# EAGLE design sata-hub3 (EAGLE 6.5.0)
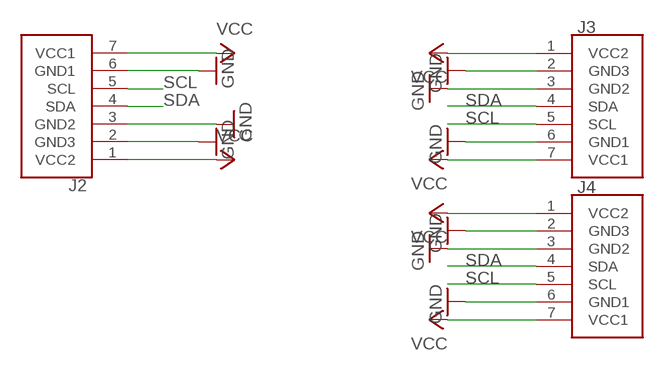
[diagram p0: schematic, sheet 1]

## Parts
J2  SATA7-RA  [SATA7-RA]
J3  SATA7-RA  [SATA7-RA]
J4  SATA7-RA  [SATA7-RA]

## Nets
GND: J2.2(GND3) J2.3(GND2) J2.6(GND1) J3.2(GND3) J3.3(GND2) J3.6(GND1) J4.2(GND3) J4.3(GND2) J4.6(GND1)
SCL: J2.5(SCL) J3.5(SCL) J4.5(SCL)
SDA: J2.4(SDA) J3.4(SDA) J4.4(SDA)
VCC: J2.1(VCC2) J2.7(VCC1) J3.1(VCC2) J3.7(VCC1) J4.1(VCC2) J4.7(VCC1)

## Library data of the parts
J2-J4 = dan-pc:SATA7: SATA 7-pin connector From host perspective, A is transmit and B is receive.

## Board
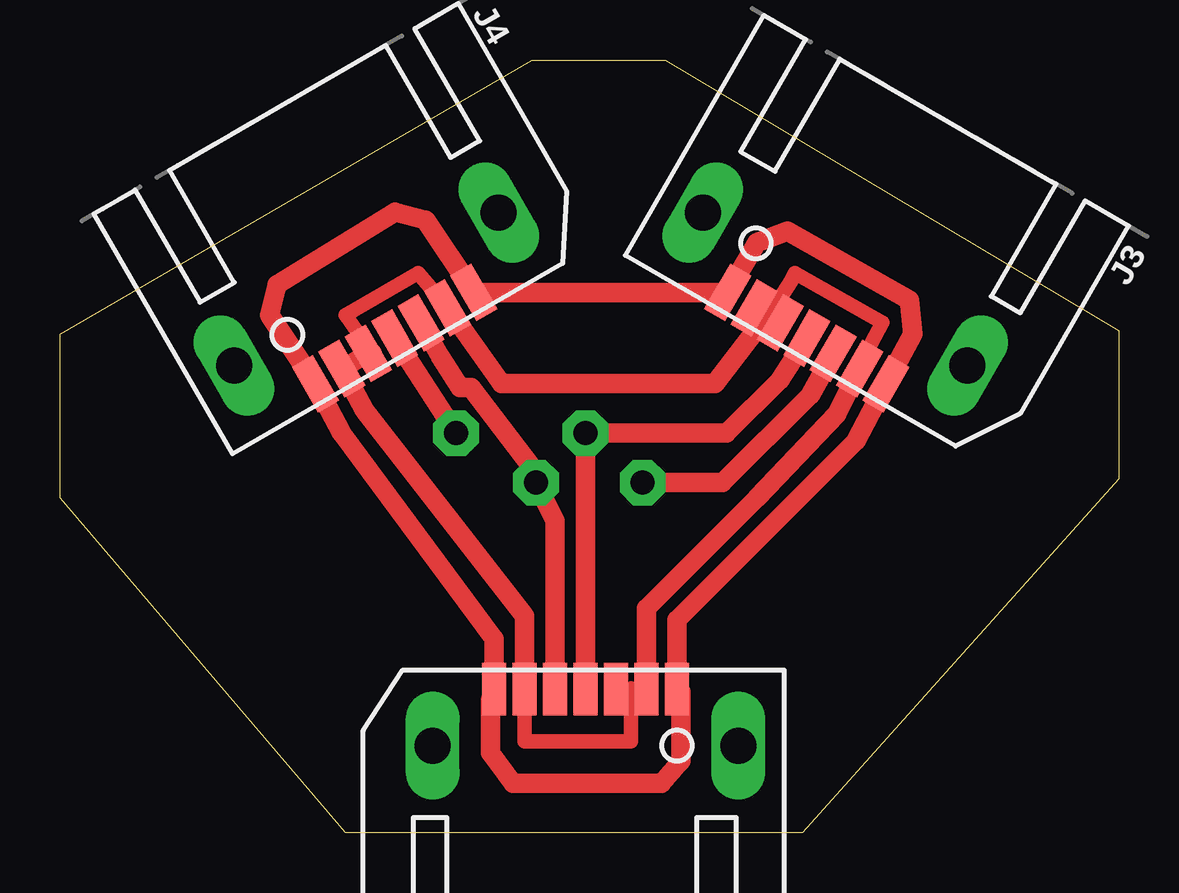
[diagram p1: board, top side]
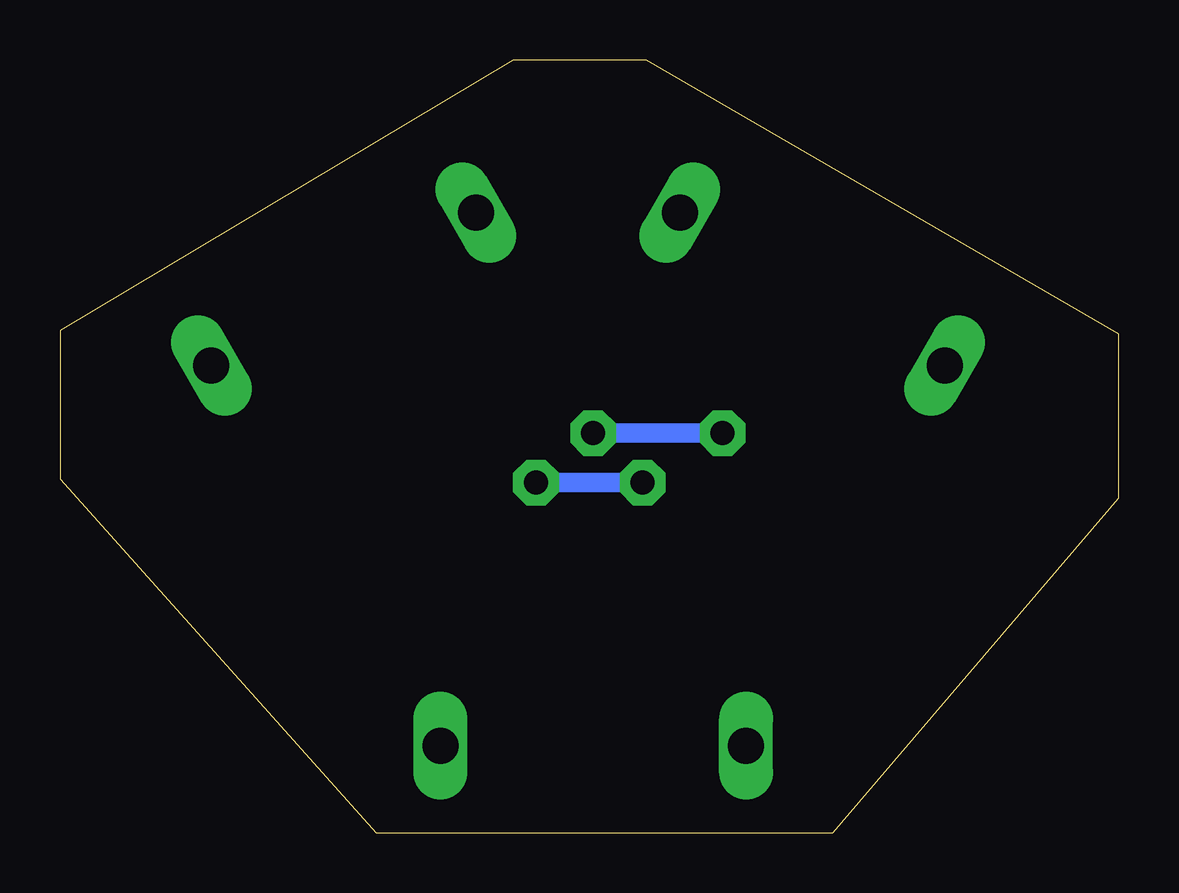
[diagram p2: board, bottom side, seen from below]

Size 44.13 x 32.23 mm. Coordinates in mm from the lower left corner, seen from the top.
Outline: 0,20.8 19.68,32.23 25.24,32.23 44.13,20.96 44.13,14.76 30.96,0 11.91,0 0,13.97 0,20.8
Copper layers (1*16): Top 0.035mm / dielectric 1.5mm / Bottom 0.035mm
Design rules "default *": minimum track width 10mil, minimum drill 24mil, track to track 8mil, track to pad 8mil, pad to pad 8mil, via to via 8mil, smd to smd 8mil, copper to edge 40mil, drill to drill 8mil, minimum pad ring 10mil, minimum via ring 8mil, stop-mask expansion 4mil, vias tented up to drill 0mil, thermal gap 10mil

### Footprints (pad centres in the part's own frame; a part is rotated, then mirrored left to right if it is on the bottom)
SATA7-RA = smd 2.2 x 1: 1 -4.41,3.81; 2 -4.41,2.54; 3 -4.41,1.27; 4 -4.41,0; 5 -4.41,-1.27; 6 -4.41,-2.54; 7 -4.41,-3.81 | drill 1.5 long: M1 -2.05,-6.37; M2 -2.05,6.37

### Placement (x,y rotation side)
J2  21.91,1.59 270 top
J3  33.34,24.45 60 top
J4  11.75,24.45 120 top

### Tracks (layer width: path | path; a pad name or v marks a point on that pad's centre or on a via)
GND
  Top 0.61: J2.6 19.37,3.81 23.81,3.81 23.81,6.03 | 23.81,6.03 J2.3 | J2.2 23.81,6.03 | 13.02,20 11.91,21.59 14.92,23.34 J4.6
  Top 0.813: J2.2 24.45,9.37 29.05,13.97 32.39,17.46 J3.6 | J3.3 29.48,21.58 | 29.48,21.58 J3.2 | J2.6 19.37,9.05 12.7,17.62 J4.2 J4.3 13.02,20 | J4.6 18.42,18.73 27.3,18.73 29.48,21.58
N$1
  Top 0.813: 17.94,5.56 17.94,3.33 18.89,2.06 25.08,2.06 25.88,3.02 25.88,5.87
N$2
  Top 0.61: 29.69,21.75 30.48,23.02 30.64,23.34 34.29,21.27 33.34,19.53
SCL  (via drill 1)
  Top 0.813: J2.5 20.64,13.02 v19.84,14.61 19.68,14.61 19.68,15.24 17.15,18.57 16.67,18.57 15.87,19.84 J4.5 | v24.29,14.61 27.62,14.61 31.27,18.26 J3.5
  Bottom 0.813: v19.84,14.61 v24.29,14.61
SDA  (via drill 1)
  Top 0.813: J4.4 v16.51,16.67 | J3.4 30,18.89 27.78,16.67 v21.91,16.67 J2.4
  Bottom 0.813: v16.51,16.67 v21.91,16.67
VCC
  Top 0.813: J2.1 25.72,8.89 33.18,16.35 J3.7 35.56,20.8 35.4,22.22 30.32,25.08 29.05,24.61 J3.1 J4.7 15.24,25.56 13.97,25.88 9.05,22.86 8.73,21.59 J4.1 11.75,16.67 18.1,8.1 J2.7